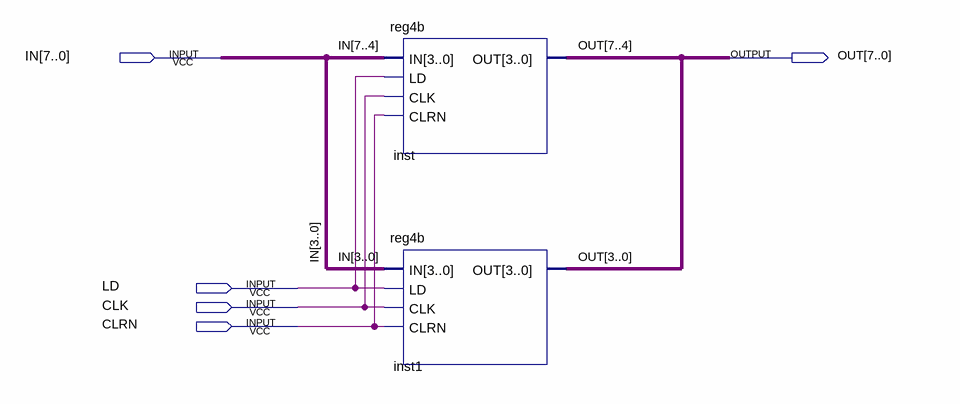
[diagram p0: schematic sheet]
// Quartus schematic reg8b.bdf as structural Verilog: 2 symbols, 5 pins
module reg8b (
  input  [7:0] IN,
  input  LD,
  input  CLK,
  input  CLRN,
  output [7:0] OUT
);

  reg4b inst (.IN(IN[7:4]), .LD(LD), .CLK(CLK), .CLRN(CLRN), .OUT(OUT[7:4]));
  reg4b inst1 (.IN(IN[3:0]), .LD(LD), .CLK(CLK), .CLRN(CLRN), .OUT(OUT[3:0]));
endmodule
